# Altium schematic sheet GateDriver.SchDoc
size A; SheetNumber: 2; SheetTotal: 12
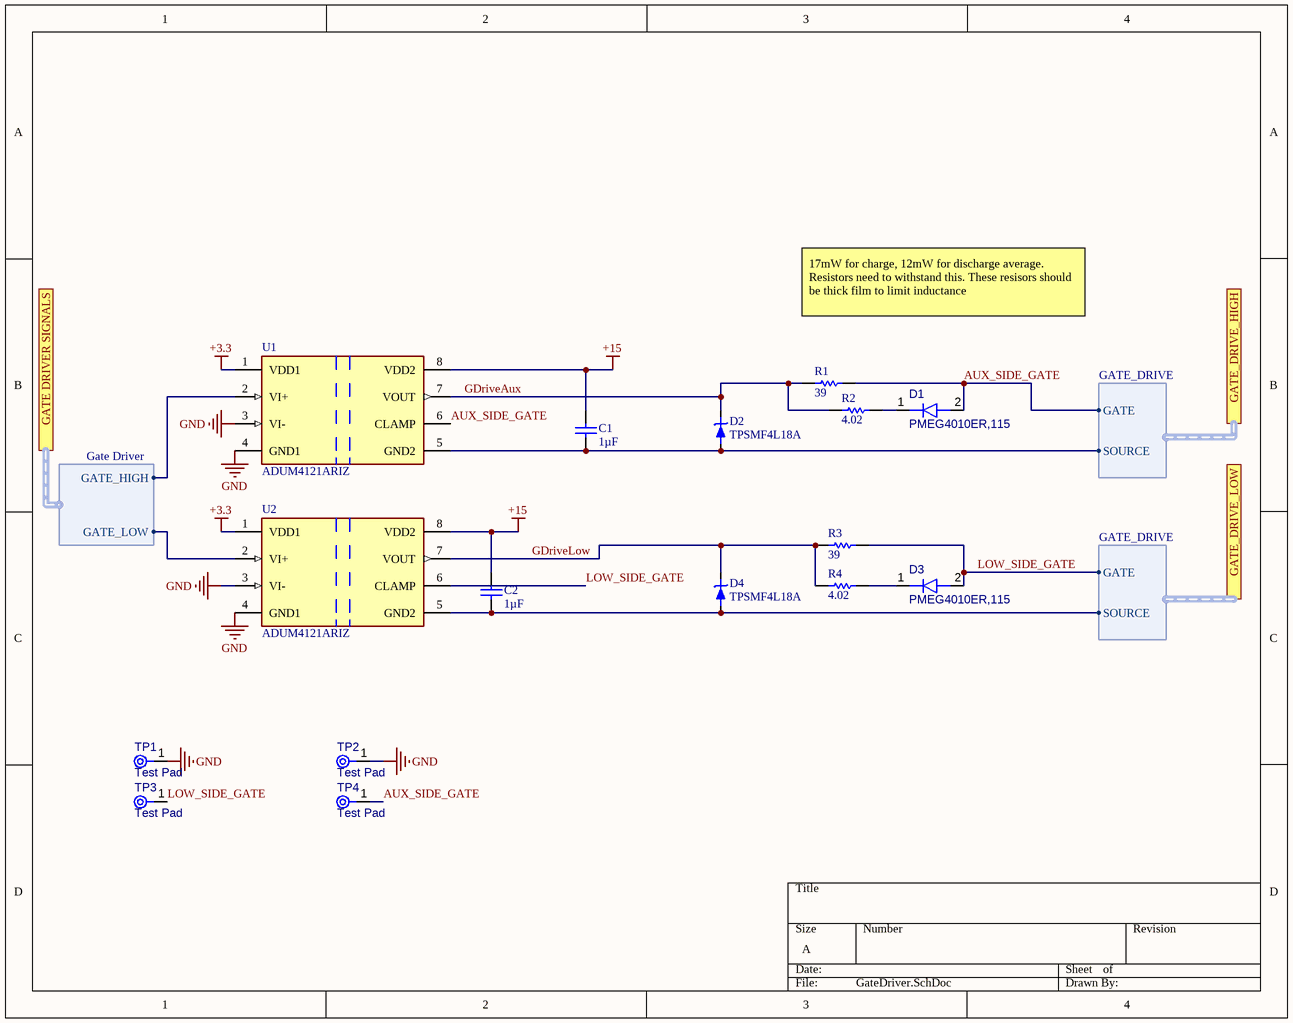
[diagram p0: GateDriver.SchDoc]

## Parts
C1  value 1µF  [0805_Capacitor]  (hidden comment: CAP 0805 1uF 50V)
C2  value 1µF  [0805_Capacitor]  (hidden comment: CAP 0805 1uF 50V)
D1  PMEG4010ER,115  [PMEG4010ER,115-Footprint-1]
D2  TPSMF4L18A  [TPSMF4L18A-Footprint-1]
D3  PMEG4010ER,115  [PMEG4010ER,115-Footprint-1]
D4  TPSMF4L18A  [TPSMF4L18A-Footprint-1]
R1  value 39  [0805_Resistor]  (hidden comment: RMCF0805JT39R0)
R2  value 4.02  [0805_Resistor]  (hidden comment: CRCW08054R02FKEA)
R3  value 39  [0805_Resistor]  (hidden comment: RMCF0805JT39R0)
R4  value 4.02  [0805_Resistor]  (hidden comment: CRCW08054R02FKEA)
TP1  Test Pad  [Test Pad-Footprint-1]  (no BOM)
TP2  Test Pad  [Test Pad-Footprint-1]  (no BOM)
TP3  Test Pad  [Test Pad-Footprint-1]  (no BOM)
TP4  Test Pad  [Test Pad-Footprint-1]  (no BOM)
U1  ADUM4121ARIZ  [FP-RI-8-1-IPC_B]
U2  ADUM4121ARIZ  [FP-RI-8-1-IPC_B]

## Ports
GATE DRIVER SIGNALS (harness Gate Driver, see MPPT[1C], MicroController[3A]), GATE_DRIVE_HIGH (harness GATE_DRIVE, see MPPT[1C], Power[4C]), GATE_DRIVE_LOW (harness GATE_DRIVE, see MPPT[1B], Power[3C])

## Harnesses
Gate Driver: GATE_HIGH, GATE_LOW
GATE_DRIVE: SOURCE, GATE

## Nets
+3.3: U1.1(VDD1) U2.1(VDD1)
+15: C1.2 C2.2 U1.8(VDD2) U2.8(VDD2)
GND: TP1.1(TP) TP2.1(TP) U1.3(VI-) U1.4(GND1) U2.3(VI-) U2.4(GND1)
AUX_SIDE_GATE: D1.2(A) R1.2 TP4.1(TP) U1.6(CLAMP) ; port GATE_DRIVE_HIGH.GATE
GDriveAux: D2.2(Cathode) R1.1 R2.1 U1.7(VOUT)
GDriveLow: D4.2(Cathode) R3.1 R4.1 U2.7(VOUT)
LOW_SIDE_GATE: D3.2(A) R3.2 TP3.1(TP) U2.6(CLAMP) ; port GATE_DRIVE_LOW.GATE
NetC1_1: C1.1 D2.1(Anode) U1.5(GND2) ; port GATE_DRIVE_HIGH.SOURCE
NetC2_1: C2.1 D4.1(Anode) U2.5(GND2) ; port GATE_DRIVE_LOW.SOURCE
NetD1_1: D1.1(K) R2.2
NetD3_1: D3.1(K) R4.2
NetU1_2: U1.2(VI+) ; port GATE DRIVER SIGNALS.GATE_HIGH
NetU2_2: U2.2(VI+) ; port GATE DRIVER SIGNALS.GATE_LOW

## Notes on the sheet
- 17mW for charge, 12mW for discharge average. Resistors need to withstand this. These resisors should be thick film to limit inductance

## Library data of the parts
C1 C2 = CMP-001-00098-1: Tolerance: 10%; Capacitor Type: Ceramic; Voltage Rating: 50V; Case/Package: 0805; Mounting Technology: SMT
D1 D3 = CMP-004-00045-1: Rectifier Diode, Schottky, 1 Phase, 1 Element, 1A, 40V V(RRM), Silicon; Max Surge Current: 40A; Forward Voltage: 490mV; Forward Current: 1A; Peak Inverse Voltage: 40V; Max Operating Temperature: 150°C; Case/Package: SOD-123W; RoHS Compliant: Yes; Pins: 2; Mounting Technology: SMD
D2 D4 = CMP-004-00053-2: TVS DIODE 18V 29.2V SOD123FL; Min Breakdown Voltage: 20V; Peak Pulse Power: 400W; Number of Unidirectional Channels: 1; Peak Pulse Current: 13.7A; Power Line Protection: No; Max Operating Temperature: 150°C; Packaging: Cut Tape; Min Operating Temperature: -55°C; RoHS Compliant: Yes; Reverse Standoff Voltage: 18V; Resistor Type: Zener; Mounting Technology: Surface Mount; Clamping Voltage: 29.2V
R1 R3 = Resistor     0012-1: Fixed Resistor, Metal Glaze/thick Film, 0.125W, 39ohm, 150V, 5% +/-Tol, 200ppm/Cel, Surface Mount, 0805; Power: 125mW; Mounting Technology: SMD; Min Operating Temperature: -55°C; RoHS Compliant: Yes; Tolerance: 5%; Max Operating Temperature: 155°C; Case/Package: 0805
R2 R4 = Resistor     0013-1: Fixed Resistor, Metal Glaze/thick Film, 0.125W, 4.02ohm, 150V, 1% +/-Tol, 100ppm/Cel, Surface Mount, 0805; Power: 125mW; Tolerance: 1%; Mounting Technology: SMD; Min Operating Temperature: -55°C; Case/Package: 0805; RoHS Compliant: Yes; Max Operating Temperature: 155°C
TP1-TP4 = CMP-00039-1: A circular test pad for soldering a wire to or spring tip if necessary
U1 U2 = CMP-00024-00007-1: 2A gat driver; Pins: 8; RoHS Compliant: Yes; Max Operating Temperature: 125°C; Min Operating Temperature: -40°C